# EAGLE schematic untitled (EAGLE 9.6.2)
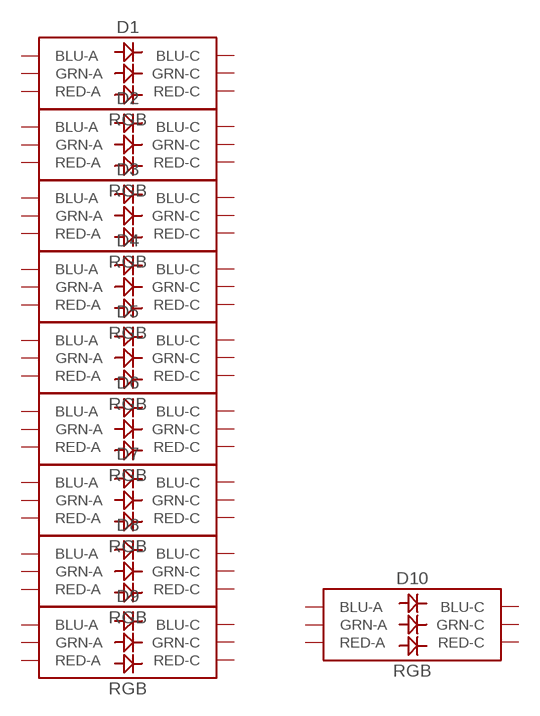
[diagram p0: schematic, sheet 1]

## Parts
D1  RGB  LED-RGBPLCC-6  [PLCC-6-LED]
D2  RGB  LED-RGBPLCC-6  [PLCC-6-LED]
D3  RGB  LED-RGBPLCC-6  [PLCC-6-LED]
D4  RGB  LED-RGBPLCC-6  [PLCC-6-LED]
D5  RGB  LED-RGBPLCC-6  [PLCC-6-LED]
D6  RGB  LED-RGBPLCC-6  [PLCC-6-LED]
D7  RGB  LED-RGBPLCC-6  [PLCC-6-LED]
D8  RGB  LED-RGBPLCC-6  [PLCC-6-LED]
D9  RGB  LED-RGBPLCC-6  [PLCC-6-LED]
D10  RGB  LED-RGBPLCC-6  [PLCC-6-LED]
Unconnected: D1.AB(BLU-A) D1.AG(GRN-A) D1.AR(RED-A) D1.CB(BLU-C) D1.CG(GRN-C) D1.CR(RED-C) D2.AB(BLU-A) D2.AG(GRN-A) D2.AR(RED-A) D2.CB(BLU-C) D2.CG(GRN-C) D2.CR(RED-C) D3.AB(BLU-A) D3.AG(GRN-A) D3.AR(RED-A) D3.CB(BLU-C) D3.CG(GRN-C) D3.CR(RED-C) D4.AB(BLU-A) D4.AG(GRN-A) D4.AR(RED-A) D4.CB(BLU-C) D4.CG(GRN-C) D4.CR(RED-C) D5.AB(BLU-A) D5.AG(GRN-A) D5.AR(RED-A) D5.CB(BLU-C) D5.CG(GRN-C) D5.CR(RED-C) D6.AB(BLU-A) D6.AG(GRN-A) D6.AR(RED-A) D6.CB(BLU-C) D6.CG(GRN-C) D6.CR(RED-C) D7.AB(BLU-A) D7.AG(GRN-A) D7.AR(RED-A) D7.CB(BLU-C) D7.CG(GRN-C) D7.CR(RED-C) D8.AB(BLU-A) D8.AG(GRN-A) D8.AR(RED-A) D8.CB(BLU-C) D8.CG(GRN-C) D8.CR(RED-C) D9.AB(BLU-A) D9.AG(GRN-A) D9.AR(RED-A) D9.CB(BLU-C) D9.CG(GRN-C) D9.CR(RED-C) D10.AB(BLU-A) D10.AG(GRN-A) D10.AR(RED-A) D10.CB(BLU-C) D10.CG(GRN-C) D10.CR(RED-C)

## Library data of the parts
D1-D10 = SparkFun-LED 2:LED-RGB: LED-RGB 6 pin RGB LED (no common connector) Packages: PLCC-6 LED-TRICOLOR-5050 - No built-in IC SparkFun Products: Digital Sandbox <https://www.sparkfun.com/products/12651> LED- SMD RGB <https://www.sparkfun.com/products/10866>; PROD_ID: DIO-12113